# Altium schematic sheet audio.SchDoc
size A4; SheetNumber: 3; SheetTotal: 4
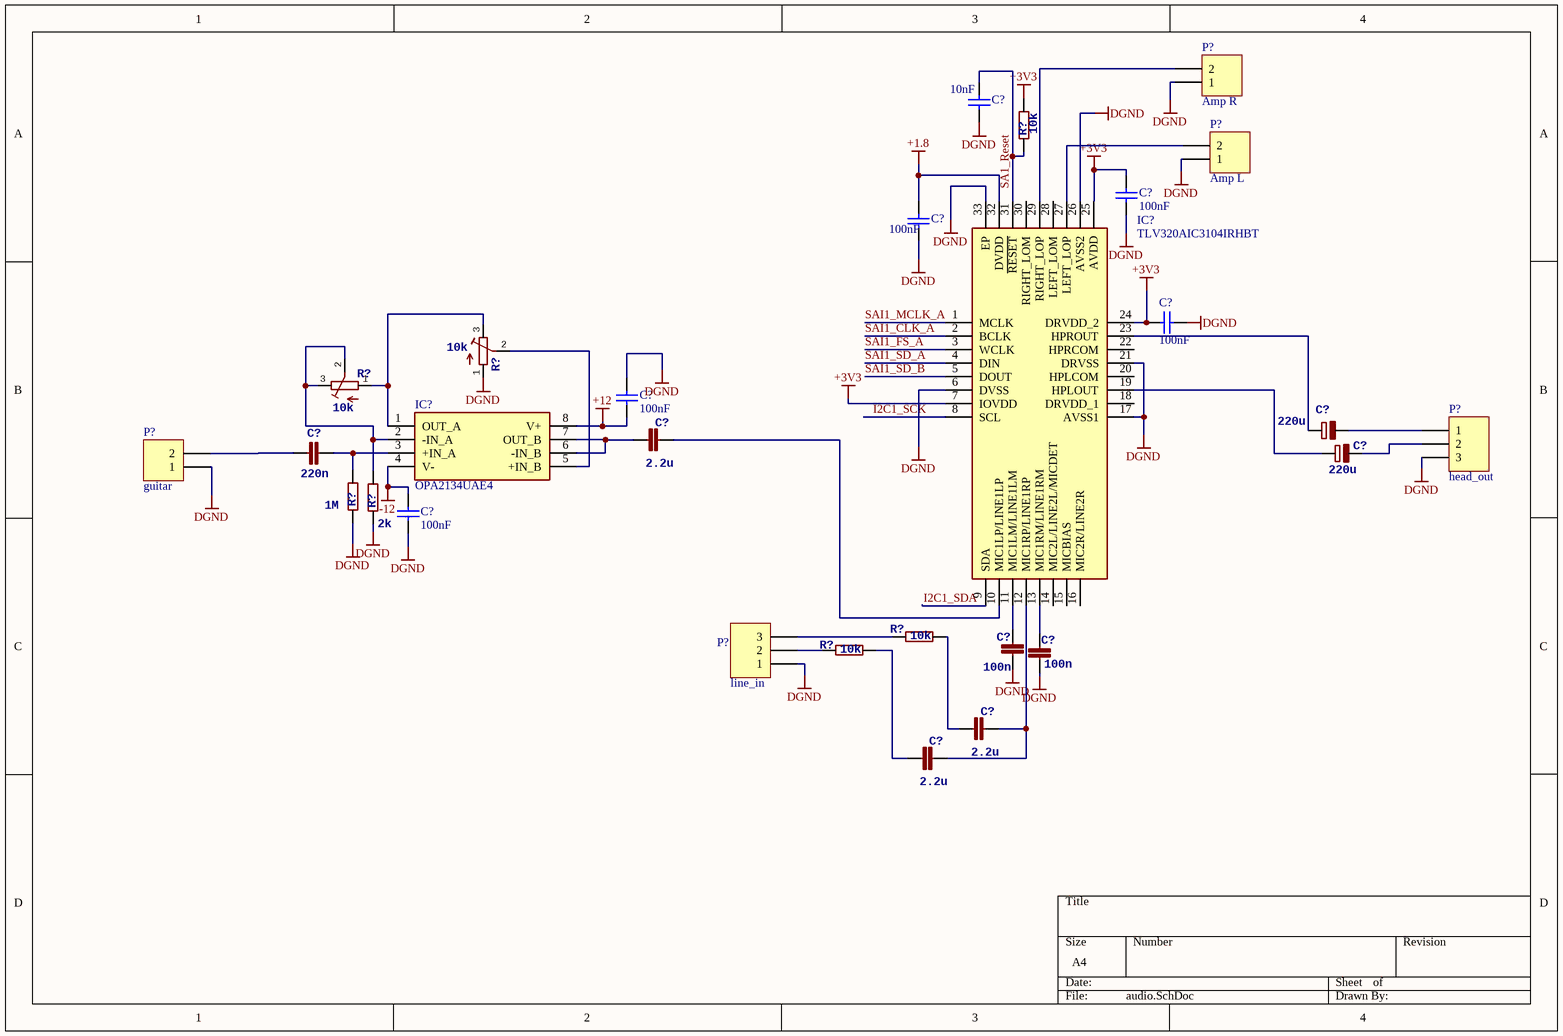
[diagram p0: audio.SchDoc]

## Parts
(Parts that share a designator on the sheet are numbered #1, #2 ... from top to bottom, then left to right.)
C?#1  value 10nF  [C0402]  (hidden comment: Capacitor)
C?#2  value 100nF  [C0402]  (hidden comment: Capacitor)
C?#3  value 100nF  [C0402]  (hidden comment: Capacitor)
C?#4  value 100nF  [C0402]  (hidden comment: Capacitor)
C?#5  value 100nF  [C0402]  (hidden comment: Capacitor)
C?#6  220u  [E2,5-7]
C?#7  2.2u  [C0805]
C?#8  220n  [C2220K]
C?#9  220u  [E2,5-7]
C?#10  value 100nF  [C0402]  (hidden comment: Capacitor)
C?#11  100n  [C2220K]
C?#12  100n  [C2220K]
C?#13  2.2u  [C0805]
C?#14  2.2u  [C0805]
IC?#1  TLV320AIC3104IRHBT  [QFN50P500X500X100-33N-D]
IC?#2  OPA2134UAE4  [SOIC127P600X175-8N]
P?#1  Amp R  [HDR1X2]
P?#2  Amp L  [HDR1X2]
P?#3  head_out  [HDR1X3]
P?#4  guitar  [HDR1X2]
P?#5  line_in  [HDR1X3]
R?#1  10k  [R0805]
R?#2  10k  [RTRIM64Y]
R?#3  10k  [RTRIM64Y]
R?#4  1M  [R0805]
R?#5  2k  [R0805]
R?#6  10k  [R0805]
R?#7  10k  [R0805]

## Nets
+1.8: C?#3.2 IC?#1.32(DVDD)
+3V3: C?#2.2 C?#4.2 IC?#1.7(IOVDD) IC?#1.24(DRVDD_2) IC?#1.25(AVDD) R?#1.2
+12: C?#5.2 IC?#2.8(V+)
-12: C?#10.1 IC?#2.4(V-)
DGND: C?#1.1 C?#2.1 C?#3.1 C?#4.1 C?#5.1 C?#10.2 C?#11.1 C?#12.1 IC?#1.6(DVSS) IC?#1.17(AVSS1) IC?#1.21(DRVSS) IC?#1.26(AVSS2) IC?#1.33(EP) P?#1.1 P?#2.1 P?#3.3 P?#4.1 P?#5.1 R?#2.1(A) R?#4.1 R?#5.1
I2C1_SCK: IC?#1.8(SCL)
I2C1_SDA: IC?#1.9(SDA)
SA1_Reset: C?#1.2 IC?#1.31(~{RESET}) R?#1.1
SAI1_CLK_A: IC?#1.2(BCLK)
SAI1_FS_A: IC?#1.3(WCLK)
SAI1_MCLK_A: IC?#1.1(MCLK)
SAI1_SD_A: IC?#1.4(DIN)
SAI1_SD_B: IC?#1.5(DOUT)
NetC?#6_+: C?#6.+ IC?#1.23(HPROUT)
NetC?#6_-: C?#6.- P?#3.1
NetC?#7_1: C?#7.1 IC?#2.6(-IN_B) IC?#2.7(OUT_B)
NetC?#7_2: C?#7.2 IC?#1.10(MIC1LP/LINE1LP)
NetC?#8_1: C?#8.1 P?#4.2
NetC?#8_2: C?#8.2 IC?#2.3(+IN_A) R?#4.2
NetC?#9_+: C?#9.+ IC?#1.19(HPLOUT)
NetC?#9_-: C?#9.- P?#3.2
NetC?#11_2: C?#11.2 IC?#1.11(MIC1LM/LINE1LM)
NetC?#12_2: C?#12.2 IC?#1.13(MIC1RM/LINE1RM)
NetC?#13_1: C?#13.1 R?#6.1
NetC?#13_2: C?#13.2 C?#14.2 IC?#1.12(MIC1RP/LINE1RP)
NetC?#14_1: C?#14.1 R?#7.1
NetIC?#1_27: IC?#1.27(LEFT_LOP) P?#2.2
NetIC?#1_29: IC?#1.29(RIGHT_LOP) P?#1.2
NetIC?#2_1: IC?#2.1(OUT_A) R?#2.3(E) R?#3.1(A)
NetIC?#2_2: IC?#2.2(-IN_A) R?#3.2(S) R?#3.3(E) R?#5.2
NetIC?#2_5: IC?#2.5(+IN_B) R?#2.2(S)
NetP?#5_2: P?#5.2 R?#7.2
NetP?#5_3: P?#5.3 R?#6.2

Not connected (* = marked no-connect by the designer): IC?#1 14(MIC2L/LINE2L/MICDET) 15(MICBIAS) 16(MIC2R/LINE2R) 18(DRVDD_1) 20(HPLCOM) 22(HPRCOM) 28(LEFT_LOM) 30(RIGHT_LOM)

## Library data of the parts
C?#1-C?#5 C?#10 = MCD-00102: Capacitor, MLCC, 100nF, 16V, X7R, 10%, 0402, T=0,5mm; Manufacturer_Part_Number: CC0402KRX7R7BB104; Manufacturer: YAGEO; Alternate_Manufacturer_Part_Number: GCM155R71C104KA55D; Alternate_Manufacturer: MURATA; ECCN_US: EAR99; ECCN_EU: NEC; Provided_By: SUBCO; Internal_Part_Number: MCD-00102; Status: Released; Part_Type: Capacitor; Package: C0402; ComponentLink1Description: Datasheet; ComponentLink1URL: http://tunmcdsvn.tun.st.com/Component_Datasheet_Library/Trunk/Capacitors/Yageo_Multilayer_Capacitor_X7R_series_100pF_to_22uF
C?#6 C?#9 = CPOL-EUE2.5-7: SPICEPREFIX: C
C?#7 C?#13 C?#14 = C-EUC0402: <B>CAPACITOR</B>, European symbol; SPICEPREFIX: C
C?#8 = C-EUC2220K: C1812C224J5GACTU Multilayer Ceramic Capacitors MLCC - SMD/SMT 50V 0.22uF C0G 1812 5%; SPICEPREFIX: C
C?#11 C?#12 = C-EUC2220K: C4532C0G2A104J320KA Multilayer Ceramic Capacitors MLCC - SMD/SMT 1812 100V 0.1uF C0G 5% T: 3.2mm; SPICEPREFIX: C
IC?#1 = TLV320AIC3104IRHBT: Integrated Circuit; Manufacturer_Name: Texas Instruments; Datasheet Link: http://www.ti.com/lit/gpn/tlv320aic3104; Height: 1mm; Manufacturer_Part_Number: TLV320AIC3104IRHBT; Mouser Part Number: 595-TLV320C3104IRHBT; Mouser Price/Stock: https://www.mouser.co.uk/ProductDetail/Texas-Instruments/TLV320AIC3104IRHBT?qs=t6sYTo5dwUz0wA7yRaTR5Q%3D%3D; Arrow Part Number: TLV320AIC3104IRHBT; Arrow Price/Stock: https://www.arrow.com/en/products/tlv320aic3104irhbt/texas-instruments.html?utm_currency=USD&region=nac
IC?#2 = OPA2134UAE4: Integrated Circuit; Manufacturer_Name: Texas Instruments; Datasheet Link: https://www.ti.com/lit/gpn/OPA2134; Height: 1.75mm; Manufacturer_Part_Number: OPA2134UAE4; Mouser Part Number: 595-OPA2134UAE4; Mouser Price/Stock: https://www.mouser.co.uk/ProductDetail/Texas-Instruments/OPA2134UAE4?qs=7nS3%252BbEUL6uzphh9X3AzMA%3D%3D
P?#1 P?#2 P?#4 = Header 2: Header, 2-Pin; LatestRevisionDate: 17-Jul-2002; LatestRevisionNote: Re-released for DXP Platform.; Publisher: Altium Limited
P?#3 P?#5 = Header 3: Header, 3-Pin; LatestRevisionDate: 17-Jul-2002; LatestRevisionNote: Re-released for DXP Platform.; Publisher: Altium Limited
R?#1 R?#4-R?#7 = R-EU_R0805: <B>RESISTOR</B>, European symbol
R?#2 R?#3 = R-TRIMM64Y: SPICEMODEL: X; SPICEPREFIXL: POT